# Altium schematic sheet Connectors.SchDoc
size A3; SheetNumber: 4; SheetTotal: 4
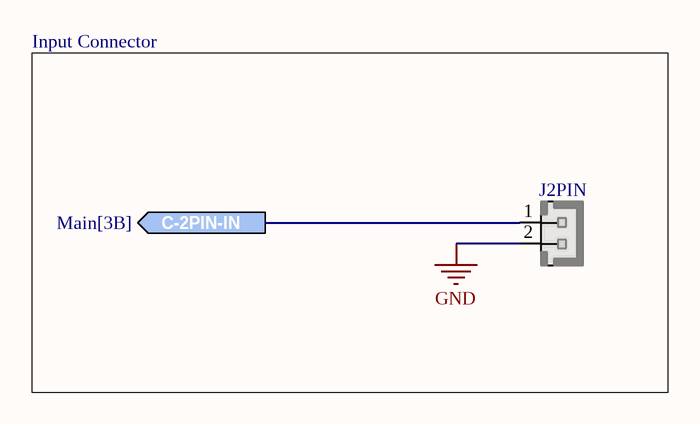
[diagram p0: Connectors.SchDoc]

## Parts
J2PIN  HHDR_2  [XH_2]  (value not drawn)

## Blocks framed on the sheet
Input Connector: J2PIN

## Ports
C-2PIN-IN (out, see Main[3B])

## Nets
GND: J2PIN.2
C-2PIN-IN: J2PIN.1 ; port C-2PIN-IN

## Library data of the parts
J2PIN = XH_2: JST-XH pitch: 2.5mm; VALUE: HHDR_2